# Altium project DIOT_PSU_integrated - Main.PrjPcb (part 2 of 2)

## Sheet IAMP.SchDoc
size A4
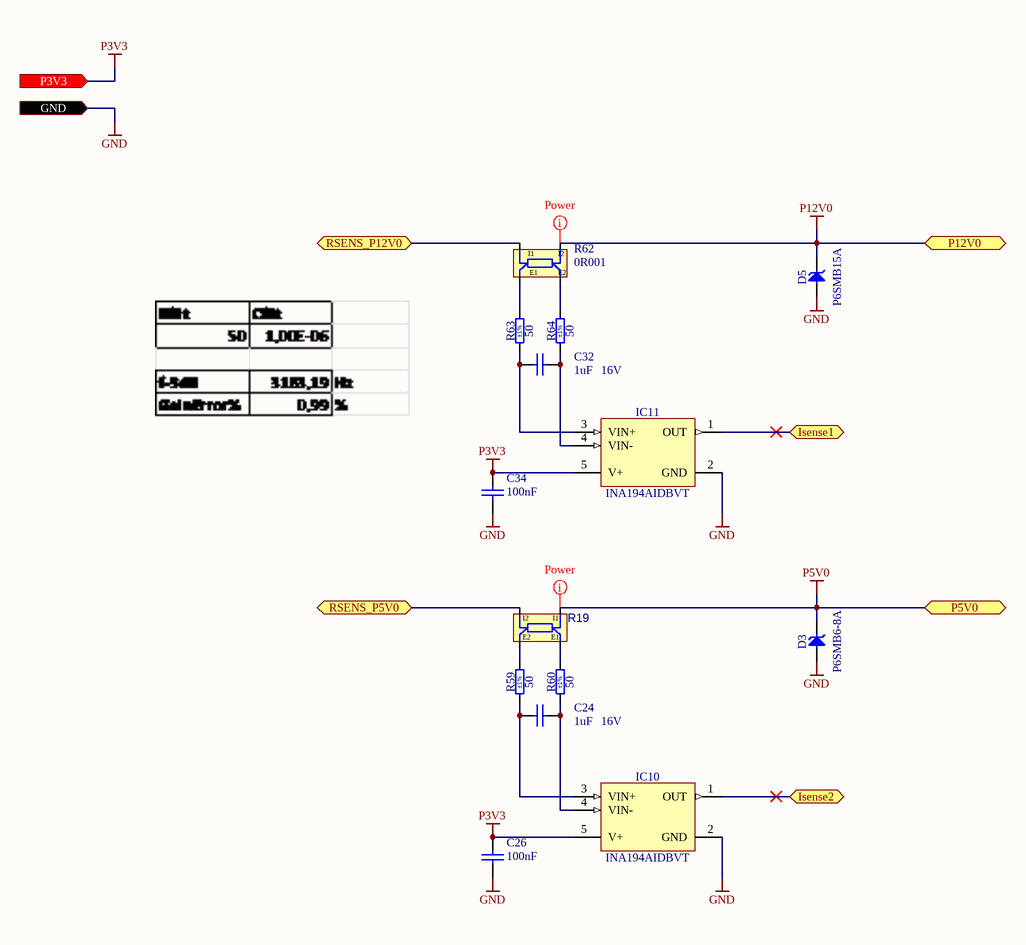
[diagram p5: IAMP.SchDoc]

### Parts
C24  1uF  Voltage: 16V  [CAPC1608X87N]
C26  100nF  [CAPC1608X87N]
C32  1uF  Voltage: 16V  [CAPC1608X87N]
C34  100nF  [CAPC1608X87N]
D3  P6SMB6-8A  [DIOM5436X261N]
D5  P6SMB15A  [DIOM5436X261N]
IC10  INA194AIDBVT  [SOT95P280X145-5N]
IC11  INA194AIDBVT  [SOT95P280X145-5N]
R19  FC4TR100DER  [FC4TR100DER]  (value not drawn)
R59  50  Tolerance: ±1%  [RESC1608X55N]
R60  50  Tolerance: ±1%  [RESC1608X55N]
R62  0R001  [RES_VISHAY_WSL3637_0R001-0R0019]
R63  50  Tolerance: ±1%  [RESC1608X55N]
R64  50  Tolerance: ±1%  [RESC1608X55N]

### Ports
GND (in), Isense1 (bidir), Isense2 (bidir), P3V3 (in), P5V0 (bidir), P12V0 (bidir), RSENS_P5V0 (bidir), RSENS_P12V0 (bidir)

### Nets
GND: C26.2 C34.2 D3.2(A) D5.2(A) IC10.2(GND) IC11.2(GND) ; port GND
P3V3: C26.1 C34.1 IC10.5(V+) IC11.5(V+) ; port P3V3
P5V0: D3.1(C) R19.I1 ; port P5V0
P5V0_SB: R19.I2 ; port RSENS_P5V0
P12V0: D5.1(C) R62.I2 ; port P12V0
Isense1: IC11.1(OUT) ; port Isense1
Isense2: IC10.1(OUT) ; port Isense2
P12V0_RSENS: R62.I1 ; port RSENS_P12V0
NetC24_1: C24.1 IC10.3(VIN+) R59.1
NetC24_2: C24.2 IC10.4(VIN-) R60.1
NetC32_1: C32.1 IC11.3(VIN+) R63.1
NetC32_2: C32.2 IC11.4(VIN-) R64.1
NetR19_E1: R19.E1 R60.2
NetR19_E2: R19.E2 R59.2
NetR62_E1: R62.E1 R63.2
NetR62_E2: R62.E2 R64.2

### Layout directives
net class Power: P5V0, P12V0

### Library data of the parts
C24 C32 = CC0603_1UF_16V_10%_X7R: Non-polarised capacitor; Part Description: SMD Multilayer Chip Ceramic Capacitor; Manufacturer: GENERIC; Manufacturer1 Part Number: 223878615663; TC: X7R; Tolerance: ±10%; Part Number: CC0603_1UF_16V_10%_X7R; Component Kind: Standard; Component Type: Standard; Pin Count: 2; Value: 1uF; Status: None; Manufacturer Part Number: CC0603_1UF_16V_10%_X7R; Case: 0603; Mounted: Yes; Socket: No; SMD: Yes; Manufacturer1 Example: YAGEO PHYCOMP; Manufacturer1 ComponentHeight: 0.9mm; HelpURL: \\cern.ch\dfs\Applications\Altium\Datasheets\CC0603_X7R_PHYCOMP.pdf; Author: CERN DEM JLC; CreateDate: 03.12.2007; LatestRevisionDate: 17.04.2015; Sense: No
C26 C34 = CC0603_100NF_50V_10%_X5R: Non-polarised capacitor; Part Description: SMD Multilayer Chip Ceramic Capacitor; Manufacturer: GENERIC; Manufacturer1 Part Number: C1608X5R1H104K080; Voltage: 50V; TC: X5R; Tolerance: ±10%; Part Number: CC0603_100NF_50V_10%_X5R; Component Kind: Standard; Component Type: Standard; Pin Count: 2; Value: 100nF; Status: None; Manufacturer Part Number: CC0603_100NF_50V_10%_X5R; Case: 0603; Mounted: Yes; Socket: No; SMD: Yes; Sense: No; Manufacturer1 Example: TDK; Manufacturer1 ComponentHeight: 0.9mm; HelpURL: \\cern.ch\dfs\Applications\Altium\Datasheets\CC0603_X5R_TDK_C.pdf; Author: CERN DEM MR; CreateDate: 08.01.2016; LatestRevisionDate: 08.01.2016
D3 = P6SMB6-8A: 10.5V Clamp 58.1A Ipp Tvs Diode Surface Mount SMB; Part Description: Uni-directional Transient Voltage Suppressor (TVS) Diode; Manufacturer: Eaton; Voltage: 15V; Power: 600W; PressFit: No; Bonding: No; Part Number: P6SMB6-8A; Component Kind: Standard; Component Type: Standard; Device: P6SMB6-8A; PackageDescription: DO-214-AA/SMB Diode, Molded Body; 5.40mm L X 3.62mm W X 2.61mm H, IPC Medium Density; Manufacturer Part Number: P6SMB6-8A; Pin Count: 2; Case: SMB; Mounted: Yes; Socket: No; SMD: Yes; Sense: No; ComponentHeight: 2.61mm; HelpURL: https://www.eaton.com/content/dam/eaton/products/electronic-components/resources/data-sheet/eaton-p6smb-tvs-diode-power-esd-suppressor-data-sheet.pdf; Author: LPA; CreateDate: 2.04.2025; LatestRevisionDate: 2.04.2025
D5 = P6SMB15A: Transient Voltage Suppressor Diode (Uni-Directional); Part Description: Uni-directional Transient Voltage Suppressor (TVS) Diode; Manufacturer: LITTELFUSE; Voltage: 15V; Power: 600W; PressFit: No; Bonding: No; Part Number: P6SMB15A; Component Kind: Standard; Component Type: Standard; Device: P6SMB15A; PackageDescription: DO-214-AA/SMB Diode, Molded Body; 5.40mm L X 3.62mm W X 2.61mm H, IPC Medium Density; Manufacturer Part Number: P6SMB15A; Pin Count: 2; Case: SMB; Mounted: Yes; Socket: No; SMD: Yes; Sense: No; ComponentHeight: 2.61mm; HelpURL: \\cern.ch\dfs\Applications\Altium\Datasheets\P6SMB15A.pdf; Author: CERN DEM JLC; CreateDate: 12.07.2017; LatestRevisionDate: 12.07.2017
IC10 IC11 = INA194AIDBVT: Current Shunt Monitor -16V to +80V Common-Mode Range; Manufacturer: TEXAS INSTRUMENTS; PressFit: No; Bonding: No; Part Number: INA194AIDBVT; Component Kind: Standard; Component Type: Standard; Device: INA194AIDBVT; PackageDescription: SOT, 0.95mm Pitch; 5 Pin, 1.60mm W X 2.90mm L X 1.45mm H body, IPC Medium Density; Part Description: Current Shunt Monitor -16V to +80V Common-Mode Range; Manufacturer Part Number: INA194AIDBV; Pin Count: 5; Case: SOT23-5; Mounted: Yes; Socket: No; SMD: Yes; Sense: No; ComponentHeight: 1.45mm; Author: CERN DEM JLC; HelpURL: \\cern.ch\dfs\Applications\Altium\Datasheets\INA194AIDBVT.pdf; CreateDate: 10.05.2010; LatestRevisionDate: 10.05.2010
R19 = CMP-009-04019-1: Fixed Resistor, Metal Foil, 0.5W, 0.1ohm, 0.5% +/-Tol, 50ppm/Cel, Surface Mount, 1206; RoHS Compliant: Yes; Pins: 2
R59 R60 R63 R64 = R0603_50R_1%_0.1W_100PPM: Resistor - 1%; Part Description: General Purpose Thick Film Chip Resistor; Manufacturer: GENERIC; Manufacturer1 Part Number: CRCW060350R0FKEA; Power: 0.1W; TC: ±100ppm/°C; PressFit: No; Part Number: R0603_50R_1%_0.1W_100PPM; Component Kind: Standard; Component Type: Standard; Pin Count: 2; Value: 50; Status: Preferred; Manufacturer Part Number: R0603_50R_1%_0.1W_100PPM; Case: 0603; Mounted: Yes; Sense: No; Socket: No; SMD: Yes; Manufacturer1 Example: VISHAY; Manufacturer1 ComponentHeight: 0.50mm; HelpURL: \\cern.ch\dfs\Applications\Altium\Datasheets\R0603_VISHAY_CRCW e3.pdf; Author: CERN DEM MR; CreateDate: 08.09.2017; LatestRevisionDate: 08.09.2017
R62 = R3637_0R001_1%_3W_50PPM_VISHAY_WSL3637: Power and Current Sensing Resistor; Part Description: Power Metal Strip® Resistor, Low Value; Manufacturer: VISHAY DALE; Manufacturer Part Number: WSL36371L000FEA; Power: 3W; TC: ±75ppm/°C; Tolerance: ±1%; PressFit: No; Part Number: R3637_0R001_1%_3W_50PPM_VISHAY_WSL3637; Component Kind: Standard; Component Type: Standard; Pin Count: 4; Value: 0R001; Status: None; Case: 3637; Mounted: Yes; Sense: No; Socket: No; SMD: Yes; ComponentHeight: 0.89mm; HelpURL: \\cern.ch\dfs\Applications\Altium\Datasheets\R3637_VISHAY_WSL3637.pdf; Author: CERN DEM MR; CreateDate: 02.06.2016; LatestRevisionDate: 02.06.2016

## Nets that join several sheets
GND: DIOT_PSU_integrated (30 pins), LED_Bargraph (9 pins), PSU (13 pins), EEPROM (5 pins), ADC (23 pins), IAMP (6 pins)
P3V3: DIOT_PSU_integrated (C16.1 D4.4 IC9.1), EEPROM (C13.1 IC7.8), ADC (10 pins), IAMP (C26.1 C34.1 IC10.5 IC11.5)
P5V0: DIOT_PSU_integrated (10 pins), LED_Bargraph (14 pins), ADC (R52.1), IAMP (D3.1 R19.I1)
P5V0_SB: DIOT_PSU_integrated (J2.3 J2.4 J2.5 J2.6), IAMP (R19.I2)
P12V0: DIOT_PSU_integrated (J1.P8 J1.P9 TP3.1), ADC (R53.1), IAMP (D5.1 R62.I2)
I2C_SCL: DIOT_PSU_integrated (D4.2 J1.C2 TP1.1), EEPROM (IC7.6), ADC (IC8.3 R49.1)
I2C_SDA: DIOT_PSU_integrated (D4.3 J1.B1 TP2.1), EEPROM (IC7.5), ADC (IC8.4 R48.1)
Isense1: LED_Bargraph (8 pins), ADC (R46.1), IAMP (IC11.1)
Isense2: ADC (R51.1), IAMP (IC10.1)
P12V0_RSENS: PSU (J7.1), IAMP (R62.I1)
P12V_Sense: DIOT_PSU_integrated (J1.D2), PSU (J4.2 J12.2 PSU1.CN3.2)
PG: DIOT_PSU_integrated (R30.2 T1.1), PSU (J4.1 J12.4 PSU1.CN3.4)
PS-ON: DIOT_PSU_integrated (5 pins), ADC (R41.2)
RTN_Sense: DIOT_PSU_integrated (J1.D1), PSU (J4.3 J12.1 PSU1.CN3.1)

## Assembly variants
Default: not fitted C23 D3 D5 IC6 J12 J13 J14 J15 J16 J17 J18 J19 J20 J21 J22 R43 R44; alternate parts L2 -> R0603_10R_0.1%_0.063W_10PPM, L1 -> R0603_10R_0.1%_0.063W_10PPM